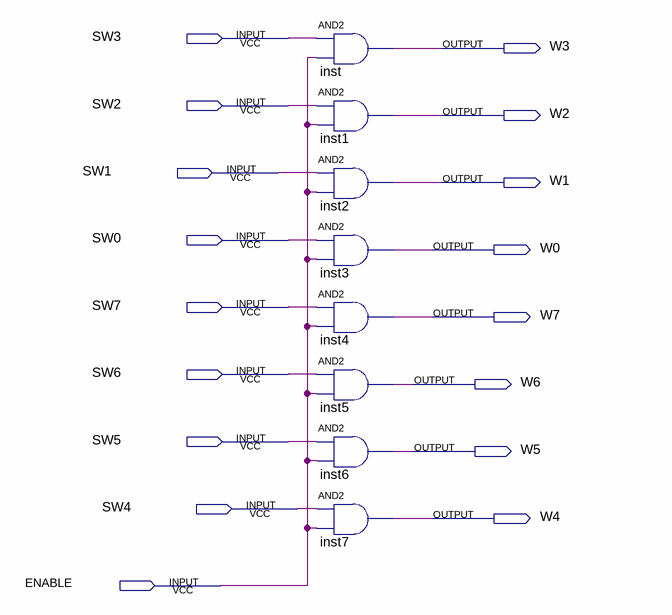
[diagram p0: schematic sheet]
// Quartus schematic EnableHEX0HEX1.bdf as structural Verilog: 8 symbols, 17 pins
module EnableHEX0HEX1 (
  input  SW3,
  input  SW2,
  input  SW1,
  input  SW0,
  input  SW7,
  input  SW6,
  input  SW5,
  input  SW4,
  input  ENABLE,
  output W3,
  output W2,
  output W1,
  output W0,
  output W7,
  output W6,
  output W5,
  output W4
);

  and inst (W3, SW3, ENABLE);
  and inst1 (W2, SW2, ENABLE);
  and inst2 (W1, SW1, ENABLE);
  and inst3 (W0, SW0, ENABLE);
  and inst4 (W7, SW7, ENABLE);
  and inst5 (W6, SW6, ENABLE);
  and inst6 (W5, SW5, ENABLE);
  and inst7 (W4, SW4, ENABLE);
endmodule
